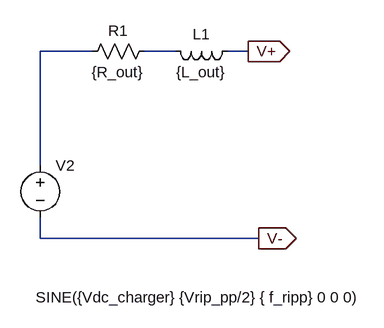
[diagram p0: schematic Carregador_Bat.asc]
Carregador_Bat.asc, the LTspice schematic file:
Version 4
SHEET 1 880 680
WIRE 112 32 32 32
WIRE 240 32 192 32
WIRE 352 32 320 32
WIRE 32 208 32 32
WIRE 32 320 32 288
WIRE 368 320 32 320
FLAG 352 32 V+
IOPIN 352 32 Out
FLAG 368 320 V-
IOPIN 368 320 Out
SYMBOL voltage 32 192 R0
WINDOW 3 -7 219 Left 2
WINDOW 123 0 0 Left 0
WINDOW 39 0 0 Left 0
SYMATTR Value SINE({Vdc_charger} {Vrip_pp/2} { f_ripp} 0 0 0)
SYMATTR InstName V2
SYMBOL res 208 16 R90
WINDOW 0 0 56 VBottom 2
WINDOW 3 32 56 VTop 2
SYMATTR InstName R1
SYMATTR Value {R_out}
SYMBOL ind 336 16 R90
WINDOW 0 5 56 VBottom 2
WINDOW 3 32 56 VTop 2
SYMATTR InstName L1
SYMATTR Value {L_out}

The netlist it stands for:
* Carregador_Bat.asc
V2 N001 V- SINE({Vdc_charger} {Vrip_pp/2} { f_ripp} 0 0 0)
R1 N002 N001 {R_out}
L1 V+ N002 {L_out}
.backanno
.end